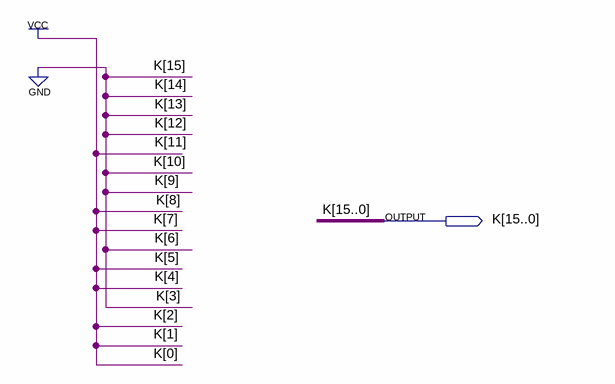
[diagram p0: schematic sheet]
// Quartus schematic K.bdf as structural Verilog: 0 symbols, 1 pins
module K (
  output [15:0] K
);


  assign K = 16'b0000100110110111;
endmodule
